# EasyEDA Pro project AmpBoard64TP.eprj, board PCB1
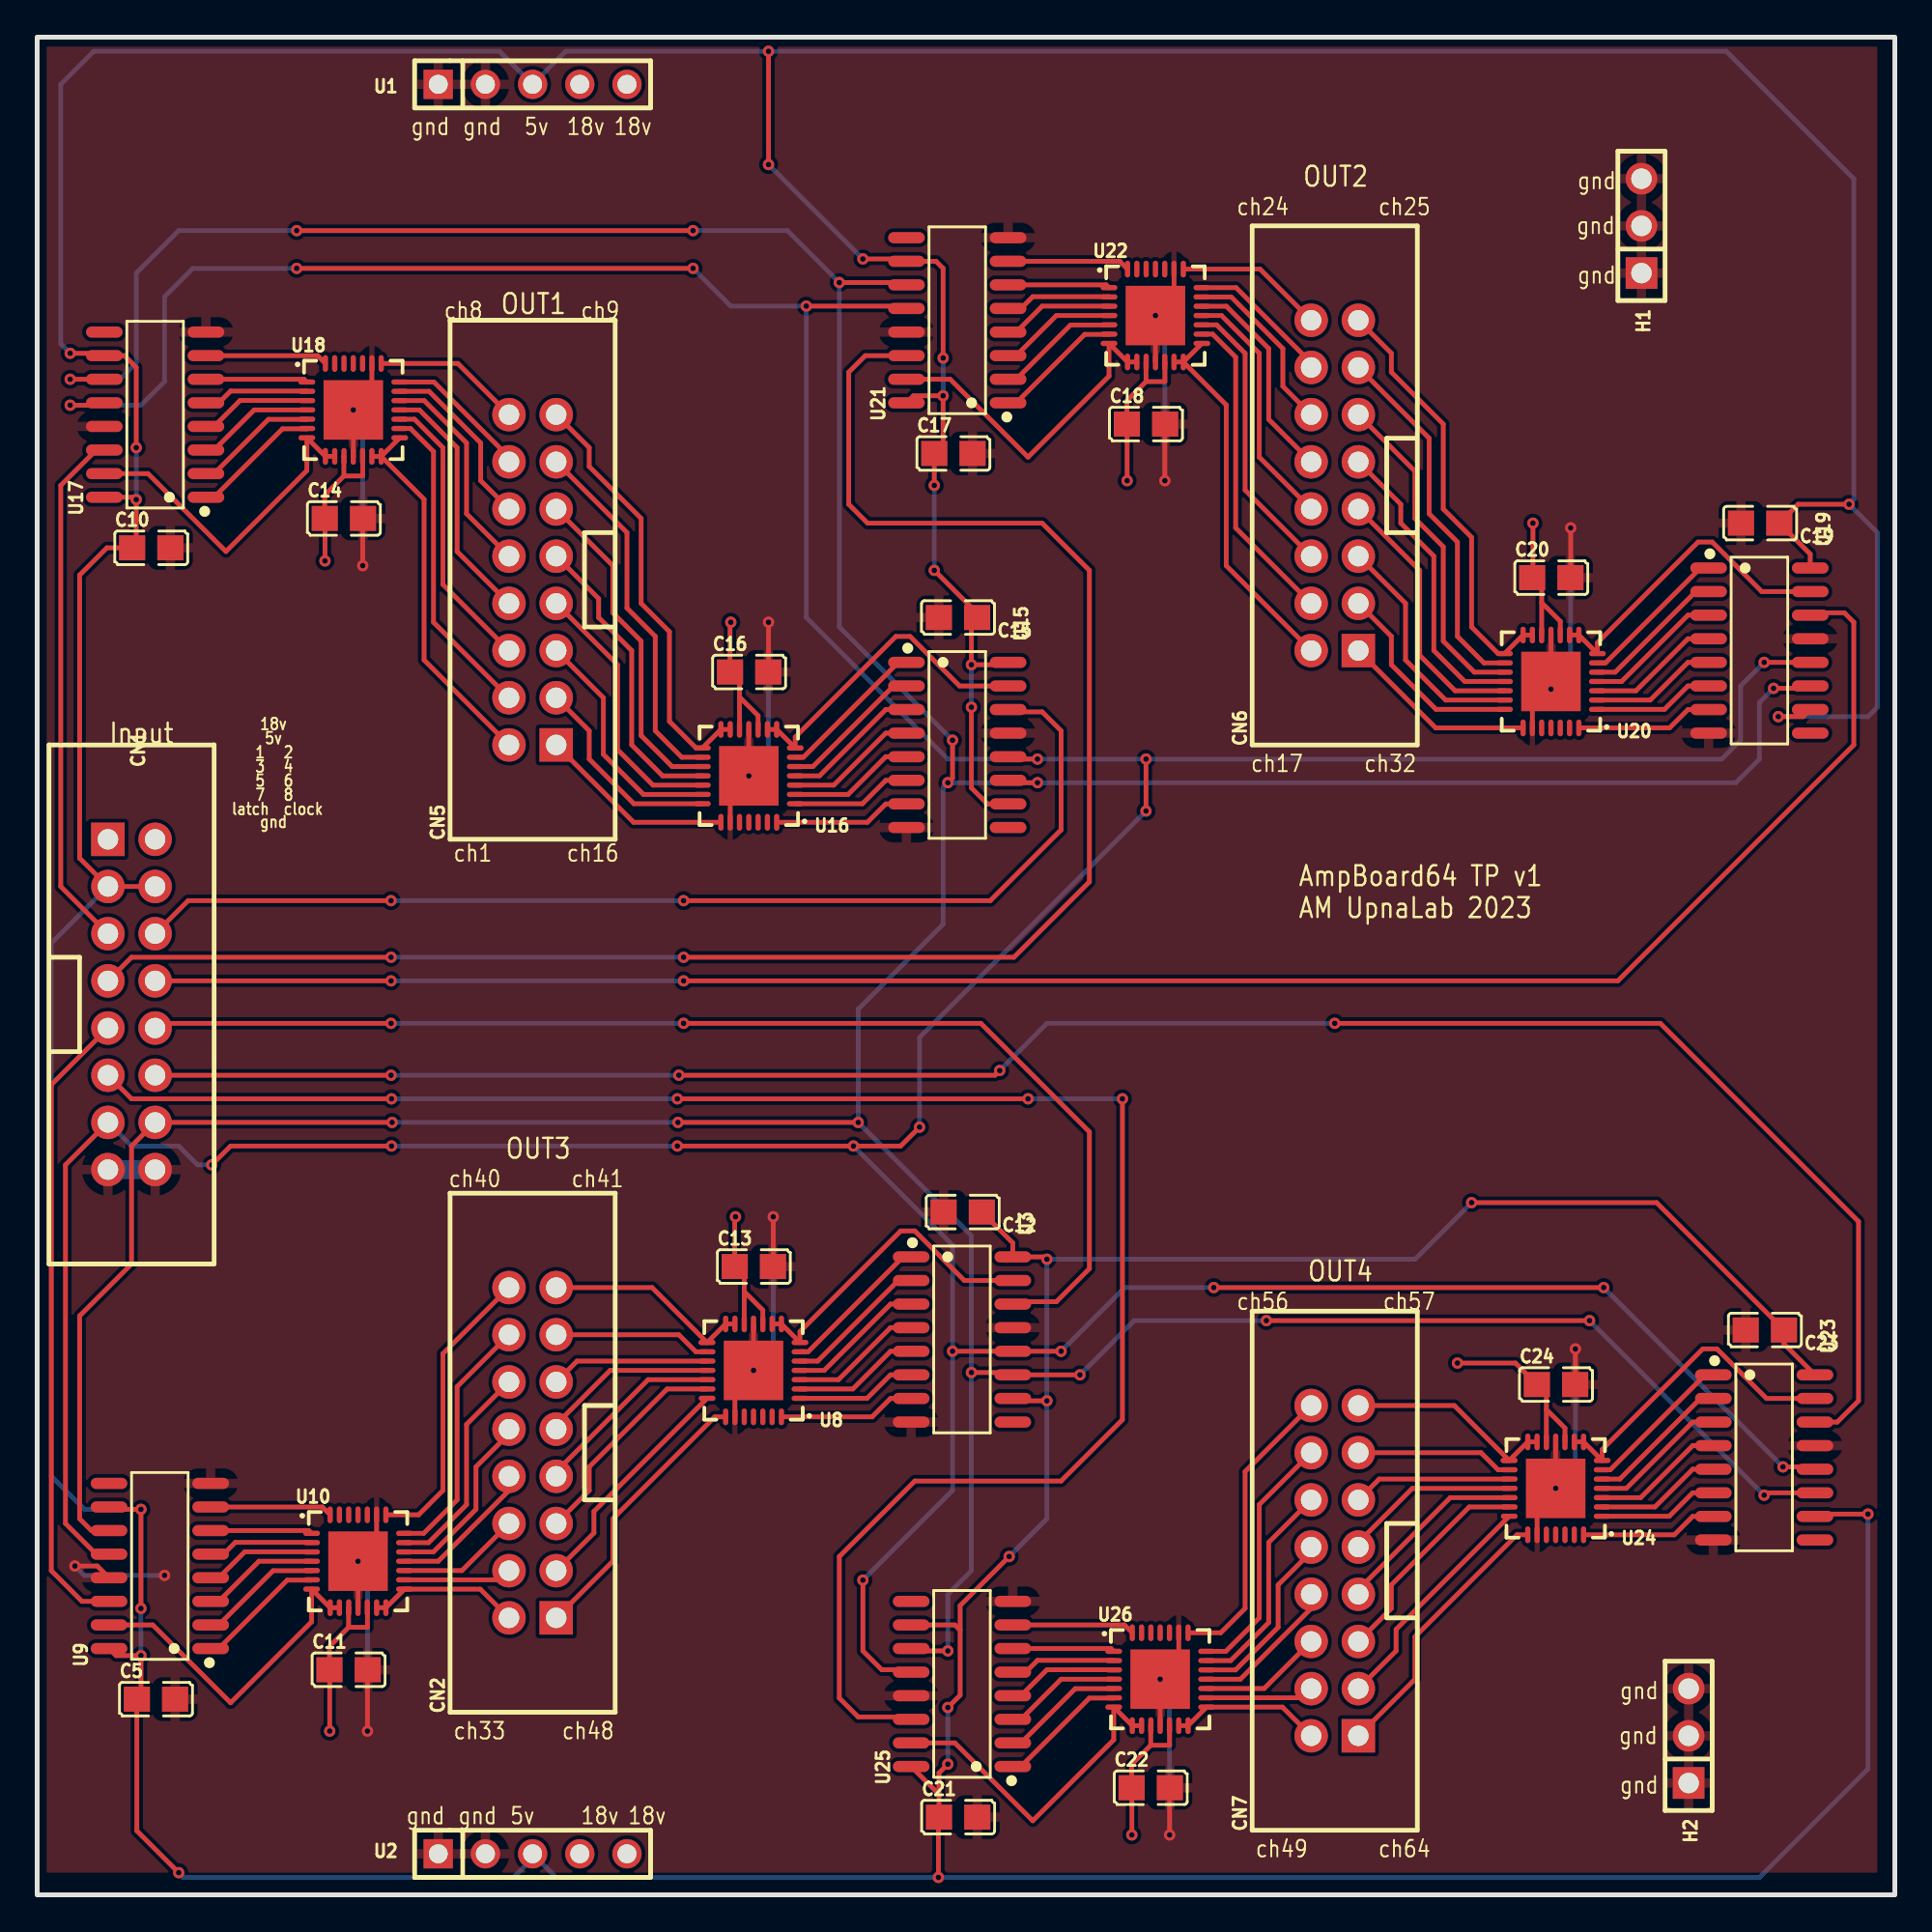
[diagram p3: board, top side]
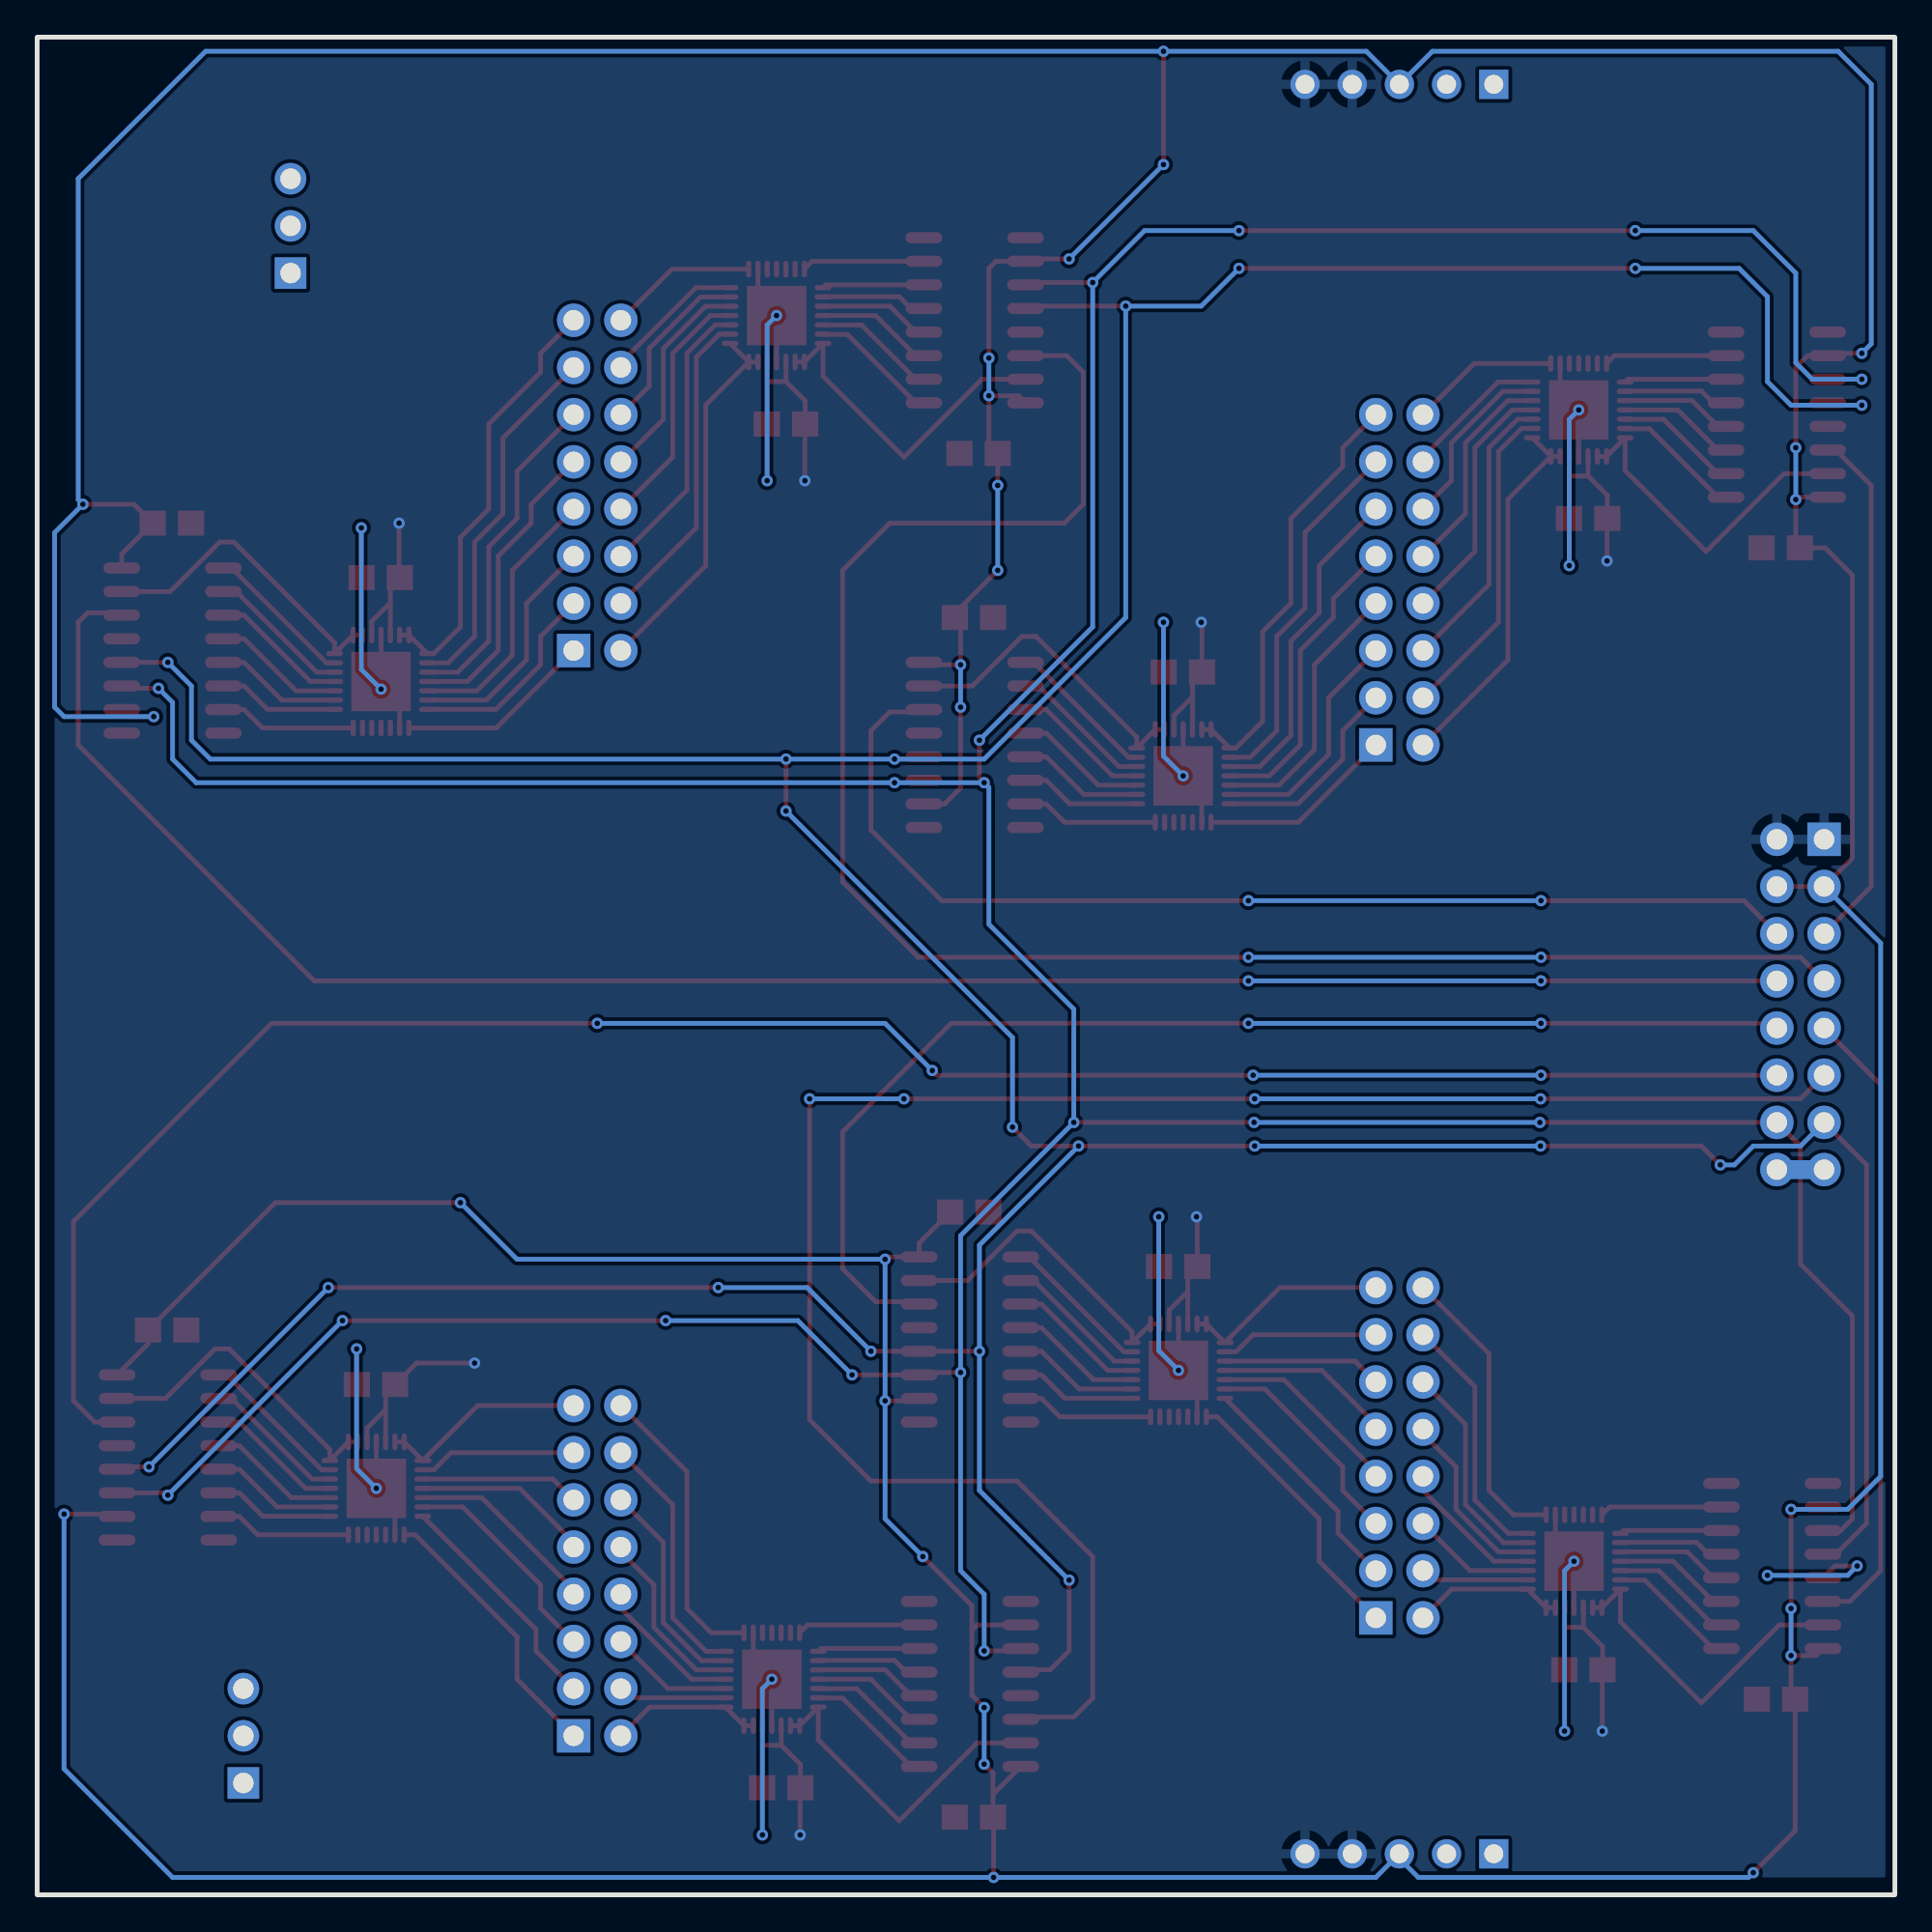
[diagram p4: board, bottom side, seen from below]

Outline 100 x 100 mm; copper layers: Top Layer, Bottom Layer. Coordinates in mm from the lower left corner of the outline.
Outline path: rectangle 0,100 100,0
Stack: Top Layer 0.035mm / Dielectric1 1.51mm FR4 er 4.5 / Bottom Layer 0.035mm

## Design rules (mm)
template: JLCPCB Capability(Two Layers Board)
spacing copperThickness1oz (default): track to track 0.102, other pairs 0.152 to 0.3
spacing copperThickness2oz: track to track 0.203, other pairs 0.152 to 0.3
track width copperThickness1oz (default): min 0.127, default 0.254, max 2.54
track width copperThickness2oz: min 0.203, default 0.254, max 2.54
differential pair differentialPair (default): width min 0.127, default 0.254, max 2.54; gap min 0.152, default 0.152
via viaSize (default): diameter min 0.5, default 0.61, max 10; hole min 0.3, default 0.305, max 6.3

## Placement (name value [footprint] x y rotation side)
C5  100pF  [C0805]  6.4 10.53 0 top
C10  100pF  [C0805]  6.14 72.51 0 top
C11  100pF  [C0805]  16.76 12.12 0 top
C12  100pF  [C0805]  49.82 36.76 180 top
C13  100pF  [C0805]  38.58 33.82 0 top
C14  100pF  [C0805]  16.51 74.09 0 top
C15  100pF  [C0805]  49.57 68.76 180 top
C16  100pF  [C0805]  38.33 65.83 0 top
C17  100pF  [C0805]  49.32 77.59 0 top
C18  100pF  [C0805]  59.69 79.17 0 top
C19  100pF  [C0805]  92.75 73.84 180 top
C20  100pF  [C0805]  81.51 70.91 0 top
C21  100pF  [C0805]  49.58 4.18 0 top
C22  100pF  [C0805]  59.94 5.77 0 top
C23  100pF  [C0805]  93 30.41 180 top
C24  100pF  [C0805]  81.76 27.47 0 top
CN1  KH-2.54PH180-2X8P-L8.9  [conn-th_16p-p2.54_kinghelm_kh-2.54ph180-2x8p-l8.9]  5.08 47.93 270 top
CN2  KH-2.54PH180-2X8P-L8.9  [CONN-TH_16P-P2.54_KINGHELM_KH-2.54PH180-2X8P-L8.9]  26.67 23.8 90 top
CN5  KH-2.54PH180-2X8P-L8.9  [CONN-TH_16P-P2.54_KINGHELM_KH-2.54PH180-2X8P-L8.9]  26.67 70.79 90 top
CN6  KH-2.54PH180-2X8P-L8.9  [CONN-TH_16P-P2.54_KINGHELM_KH-2.54PH180-2X8P-L8.9]  69.85 75.87 90 top
CN7  KH-2.54PH180-2X8P-L8.9  [CONN-TH_16P-P2.54_KINGHELM_KH-2.54PH180-2X8P-L8.9]  69.85 17.45 90 top
H1  KH-2.54PH180-1X3P-L11.5  [hdr-th_3p-p2.54-v-m]  86.36 89.84 90 top
H2  KH-2.54PH180-1X3P-L11.5  [hdr-th_3p-p2.54-v-m]  88.9 8.56 90 top
U1  KH-2.54FH-1X5P-H8.5  [hdr-th_5p-p2.54-v-f]  26.67 97.46 0 top
U2  KH-2.54FH-1X5P-H8.5  [hdr-th_5p-p2.54-v-f]  26.67 2.21 0 top
U3  74HC595D,118  [SOIC-16_L9.9-W3.9-P1.27-LS6.0-BL]  49.78 29.9 270 top
U8  TPS65190RHDR  [VQFN-28_L5.0-W5.0-P0.50-TL-EP3.2]  38.56 28.23 180 top
U9  74HC595D,118  [SOIC-16_L9.9-W3.9-P1.27-LS6.0-BL]  6.6 17.7 90 top
U10  TPS65190RHDR  [VQFN-28_L5.0-W5.0-P0.50-TL-EP3.2]  17.27 17.96 0 top
U15  74HC595D,118  [SOIC-16_L9.9-W3.9-P1.27-LS6.0-BL]  49.53 61.9 270 top
U16  TPS65190RHDR  [VQFN-28_L5.0-W5.0-P0.50-TL-EP3.2]  38.31 60.24 180 top
U17  74HC595D,118  [SOIC-16_L9.9-W3.9-P1.27-LS6.0-BL]  6.35 79.68 90 top
U18  TPS65190RHDR  [VQFN-28_L5.0-W5.0-P0.50-TL-EP3.2]  17.02 79.93 0 top
U19  74HC595D,118  [SOIC-16_L9.9-W3.9-P1.27-LS6.0-BL]  92.71 66.98 270 top
U20  TPS65190RHDR  [VQFN-28_L5.0-W5.0-P0.50-TL-EP3.2]  81.49 65.32 180 top
U21  74HC595D,118  [SOIC-16_L9.9-W3.9-P1.27-LS6.0-BL]  49.53 84.76 90 top
U22  TPS65190RHDR  [VQFN-28_L5.0-W5.0-P0.50-TL-EP3.2]  60.2 85.01 0 top
U23  74HC595D,118  [SOIC-16_L9.9-W3.9-P1.27-LS6.0-BL]  92.96 23.55 270 top
U24  TPS65190RHDR  [VQFN-28_L5.0-W5.0-P0.50-TL-EP3.2]  81.74 21.88 180 top
U25  74HC595D,118  [SOIC-16_L9.9-W3.9-P1.27-LS6.0-BL]  49.78 11.35 90 top
U26  TPS65190RHDR  [VQFN-28_L5.0-W5.0-P0.50-TL-EP3.2]  60.45 11.61 0 top

## Footprints (pads in the part's own frame, mm; a bottom-side part is the same pattern mirrored in y, then rotated)
C0805
  rect 1.41x1.35 smd: 1(-1.03,0) 2(1.03,0)
CONN-TH_16P-P2.54_KINGHELM_KH-2.54PH180-2X8P-L8.9
  rect 1.8x1.8 hole 1.1: 1(-8.89,-1.27)
  round 1.8 hole 1.1: 2(-8.89,1.27) 3(-6.35,-1.27) 4(-6.35,1.27) 5(-3.81,-1.27) 6(-3.81,1.27) 7(-1.27,-1.27) 8(-1.27,1.27) 9(1.27,-1.27) 10(1.27,1.27) 11(3.81,-1.27) 12(3.81,1.27) 13(6.35,-1.27) 14(6.35,1.27) 15(8.89,-1.27) 16(8.89,1.27)
conn-th_16p-p2.54_kinghelm_kh-2.54ph180-2x8p-l8.9
  rect 1.8x1.8 hole 1.1: 1(-8.89,-1.27)
  round 1.8 hole 1.1: 2(-8.89,1.27) 3(-6.35,-1.27) 4(-6.35,1.27) 5(-3.81,-1.27) 6(-3.81,1.27) 7(-1.27,-1.27) 8(-1.27,1.27) 9(1.27,-1.27) 10(1.27,1.27) 11(3.81,-1.27) 12(3.81,1.27) 13(6.35,-1.27) 14(6.35,1.27) 15(8.89,-1.27) 16(8.89,1.27)
hdr-th_3p-p2.54-v-m
  rect 1.7x1.7 hole 1.1: 1(-2.54,0)
  round 1.7 hole 1.1: 2(0,0) 3(2.54,0)
hdr-th_5p-p2.54-v-f
  rect 1.575x1.575 hole 1.02: 1(-5.08,0)
  round 1.575 hole 1.02: 2(-2.54,0) 3(0,0) 4(2.54,0) 5(5.08,0)
SOIC-16_L9.9-W3.9-P1.27-LS6.0-BL
  oval 0.602x1.971 smd: 1(-4.445,-2.736) 2(-3.175,-2.736) 3(-1.905,-2.736) 4(-0.635,-2.736) 5(0.635,-2.736) 6(1.905,-2.736) 7(3.175,-2.736) 8(4.445,-2.736) 9(4.445,2.736) 10(3.175,2.736) 11(1.905,2.736) 12(0.635,2.736) 13(-0.635,2.736) 14(-1.905,2.736) 15(-3.175,2.736) 16(-4.445,2.736)
VQFN-28_L5.0-W5.0-P0.50-TL-EP3.2
  oval 0.9x0.28 smd: 1(-2.5,1.502) 2(-2.5,1.001) 3(-2.5,0.5) 4(-2.5,0) 5(-2.5,-0.5) 6(-2.5,-1) 7(-2.5,-1.501) 15(2.5,-1.501) 16(2.5,-1) 17(2.5,-0.5) 18(2.5,0) 19(2.5,0.5) 20(2.5,1.001) 21(2.5,1.502)
  oval 0.28x0.9 smd: 8(-1.502,-2.5) 9(-1.001,-2.5) 10(-0.5,-2.5) 11(0,-2.5) 12(0.5,-2.5) 13(1,-2.5) 14(1.501,-2.5) 22(1.501,2.5) 23(1,2.5) 24(0.5,2.5) 25(0,2.5) 26(-0.5,2.5) 27(-1.001,2.5) 28(-1.502,2.5)
  rect 3.2x3.2 smd: 29(0,0)

## Nets
+5V: C5.1 C10.1 C12.1 C15.1 C17.1 C19.1 C21.1 C23.1 CN1.3 CN1.4 U1.3 U2.3 U3.10 U3.16 U9.10 U9.16 U15.10 U15.16 U17.10 U17.16 U19.10 U19.16 U21.10 U21.16 U23.10 U23.16 U25.10 U25.16
GND: C5.2 C10.2 C11.2 C12.2 C13.2 C14.2 C15.2 C16.2 C17.2 C18.2 C19.2 C20.2 C21.2 C22.2 C23.2 C24.2 CN1.15 CN1.16 H1.1 H1.2 H1.3 H2.1 H2.2 H2.3 U1.1 U1.2 U2.1 U2.2 U3.8 U3.13 U8.11 U8.23 U8.29 U9.8 U9.13 U10.11 U10.23 U10.29 U15.8 U15.13 U16.11 U16.23 U16.29 U17.8 U17.13 U18.11 U18.23 U18.29 U19.8 U19.13 U20.11 U20.23 U20.29 U21.8 U21.13 U22.11 U22.23 U22.29 U23.8 U23.13 U24.11 U24.23 U24.29 U25.8 U25.13 U26.11 U26.23 U26.29
VCC: C11.1 C13.1 C14.1 C16.1 C18.1 C20.1 C22.1 C24.1 CN1.1 CN1.2 U1.4 U1.5 U2.4 U2.5 U8.10 U8.12 U10.10 U10.12 U16.10 U16.12 U18.10 U18.12 U20.10 U20.12 U22.10 U22.12 U24.10 U24.12 U26.10 U26.12
CLOCK: CN1.14 U3.11 U9.11 U15.11 U17.11 U19.11 U21.11 U23.11 U25.11
LATCH: CN1.13 U3.12 U9.12 U15.12 U17.12 U19.12 U21.12 U23.12 U25.12
MUX1: CN1.5 U17.14
MUX2: CN1.6 U15.14
MUX3: CN1.7 U21.14
MUX4: CN1.8 U19.14
MUX5: CN1.9 U9.14
MUX6: CN1.10 U3.14
MUX7: CN1.11 U25.14
MUX8: CN1.12 U23.14
$1I838/$1N787: CN5.13 U16.16
$1I838/$1N791: CN5.11 U16.17
$1I838/$1N795: CN5.9 U16.18
$1I838/$1N799: CN5.7 U16.19
$1I838/$1N803: CN5.5 U16.20
$1I838/$1N807: CN5.3 U16.21
$1I838/$1N811: CN5.1 U16.22
$1I838/$1N815: CN5.15 U16.13 U16.14 U16.15
$1I838/$1N826: U15.15 U16.7 U16.8 U16.9
$1I838/$1N837: U15.1 U16.6
$1I838/$1N841: U15.2 U16.5
$1I838/$1N845: U15.3 U16.4
$1I838/$1N849: U15.4 U16.3
$1I838/$1N853: U15.5 U16.2
$1I838/$1N857: U15.6 U16.1
$1I838/$1N861: U15.7 U16.28
$1I838/$1N888: CN5.4 U18.16
$1I838/$1N892: CN5.6 U18.17
$1I838/$1N896: CN5.8 U18.18
$1I838/$1N900: CN5.10 U18.19
$1I838/$1N904: CN5.12 U18.20
$1I838/$1N908: CN5.14 U18.21
$1I838/$1N912: CN5.16 U18.22
$1I838/$1N916: CN5.2 U18.13 U18.14 U18.15
$1I838/$1N927: U17.15 U18.7 U18.8 U18.9
$1I838/$1N938: U17.1 U18.6
$1I838/$1N942: U17.2 U18.5
$1I838/$1N946: U17.3 U18.4
$1I838/$1N950: U17.4 U18.3
$1I838/$1N954: U17.5 U18.2
$1I838/$1N958: U17.6 U18.1
$1I838/$1N962: U17.7 U18.28
$1I856/$1N787: CN6.13 U20.16
$1I856/$1N791: CN6.11 U20.17
$1I856/$1N795: CN6.9 U20.18
$1I856/$1N799: CN6.7 U20.19
$1I856/$1N803: CN6.5 U20.20
$1I856/$1N807: CN6.3 U20.21
$1I856/$1N811: CN6.1 U20.22
$1I856/$1N815: CN6.15 U20.13 U20.14 U20.15
$1I856/$1N826: U19.15 U20.7 U20.8 U20.9
$1I856/$1N837: U19.1 U20.6
$1I856/$1N841: U19.2 U20.5
$1I856/$1N845: U19.3 U20.4
$1I856/$1N849: U19.4 U20.3
$1I856/$1N853: U19.5 U20.2
$1I856/$1N857: U19.6 U20.1
$1I856/$1N861: U19.7 U20.28
$1I856/$1N888: CN6.4 U22.16
$1I856/$1N892: CN6.6 U22.17
$1I856/$1N896: CN6.8 U22.18
$1I856/$1N900: CN6.10 U22.19
$1I856/$1N904: CN6.12 U22.20
$1I856/$1N908: CN6.14 U22.21
$1I856/$1N912: CN6.16 U22.22
$1I856/$1N916: CN6.2 U22.13 U22.14 U22.15
$1I856/$1N927: U21.15 U22.7 U22.8 U22.9
$1I856/$1N938: U21.1 U22.6
$1I856/$1N942: U21.2 U22.5
$1I856/$1N946: U21.3 U22.4
$1I856/$1N950: U21.4 U22.3
$1I856/$1N954: U21.5 U22.2
$1I856/$1N958: U21.6 U22.1
$1I856/$1N962: U21.7 U22.28
$1I892/$1N787: CN2.13 U8.16
$1I892/$1N791: CN2.11 U8.17
$1I892/$1N795: CN2.9 U8.18
$1I892/$1N799: CN2.7 U8.19
$1I892/$1N803: CN2.5 U8.20
$1I892/$1N807: CN2.3 U8.21
$1I892/$1N811: CN2.1 U8.22
$1I892/$1N815: CN2.15 U8.13 U8.14 U8.15
$1I892/$1N826: U3.15 U8.7 U8.8 U8.9
$1I892/$1N837: U3.1 U8.6
$1I892/$1N841: U3.2 U8.5
$1I892/$1N845: U3.3 U8.4
$1I892/$1N849: U3.4 U8.3
$1I892/$1N853: U3.5 U8.2
$1I892/$1N857: U3.6 U8.1
$1I892/$1N861: U3.7 U8.28
$1I892/$1N888: CN2.4 U10.16
$1I892/$1N892: CN2.6 U10.17
$1I892/$1N896: CN2.8 U10.18
$1I892/$1N900: CN2.10 U10.19
$1I892/$1N904: CN2.12 U10.20
$1I892/$1N908: CN2.14 U10.21
$1I892/$1N912: CN2.16 U10.22
$1I892/$1N916: CN2.2 U10.13 U10.14 U10.15
$1I892/$1N927: U9.15 U10.7 U10.8 U10.9
$1I892/$1N938: U9.1 U10.6
$1I892/$1N942: U9.2 U10.5
$1I892/$1N946: U9.3 U10.4
$1I892/$1N950: U9.4 U10.3
$1I892/$1N954: U9.5 U10.2
$1I892/$1N958: U9.6 U10.1
$1I892/$1N962: U9.7 U10.28
$1I964/$1N787: CN7.13 U24.16
$1I964/$1N791: CN7.11 U24.17
$1I964/$1N795: CN7.9 U24.18
$1I964/$1N799: CN7.7 U24.19
$1I964/$1N803: CN7.5 U24.20
$1I964/$1N807: CN7.3 U24.21
$1I964/$1N811: CN7.1 U24.22
$1I964/$1N815: CN7.15 U24.13 U24.14 U24.15
$1I964/$1N826: U23.15 U24.7 U24.8 U24.9
$1I964/$1N837: U23.1 U24.6
$1I964/$1N841: U23.2 U24.5
$1I964/$1N845: U23.3 U24.4
$1I964/$1N849: U23.4 U24.3
$1I964/$1N853: U23.5 U24.2
$1I964/$1N857: U23.6 U24.1
$1I964/$1N861: U23.7 U24.28
$1I964/$1N888: CN7.4 U26.16
$1I964/$1N892: CN7.6 U26.17
$1I964/$1N896: CN7.8 U26.18
$1I964/$1N900: CN7.10 U26.19
$1I964/$1N904: CN7.12 U26.20
$1I964/$1N908: CN7.14 U26.21
$1I964/$1N912: CN7.16 U26.22
$1I964/$1N916: CN7.2 U26.13 U26.14 U26.15
$1I964/$1N927: U25.15 U26.7 U26.8 U26.9
$1I964/$1N938: U25.1 U26.6
$1I964/$1N942: U25.2 U26.5
$1I964/$1N946: U25.3 U26.4
$1I964/$1N950: U25.4 U26.3
$1I964/$1N954: U25.5 U26.2
$1I964/$1N958: U25.6 U26.1
$1I964/$1N962: U25.7 U26.28

Pads without a net: U3 9; U8 24 25 26 27; U9 9; U10 24 25 26 27; U15 9; U16 24 25 26 27; U17 9; U18 24 25 26 27; U19 9; U20 24 25 26 27; U21 9; U22 24 25 26 27; U23 9; U24 24 25 26 27; U25 9; U26 24 25 26 27

## Via types
v1: diameter 0.61, hole 0.305, Top Layer to Bottom Layer, 104 vias

## Routing (per net, layer and track width the routed paths; a pad name or vN(x,y) marks a point on that pad's centre or on a via; arc(x,y) is an arc through that point)
+5V: length 520.9
  Top Layer w0.254: v1(48.51,0.94) 48.51,4.15 C21.1 48.55,5.41 ; v1(1.78,82.98) 3.49,82.98 U17.10 4.7,82.86 5.33,82.22 v1(5.33,77.9) ; 48.55,5.41 47.05,6.91 ; 48.55,5.41 48.55,6.56 v1(49.02,7.04) ; v1(52.32,18.21) 49.68,15.57 49.68,14.25 ; v1(48.29,71.3) 50.6,68.99 C15.1 50.29,68.45 v1(50.29,66.22) 52.14,66.22 U15.16 ; 49.68,14.25 49.68,10.75 v1(49.02,10.08) ; 49.68,14.25 49.4,14.53 47.05,14.53 ; U21.16 47.18,80.7 v1(48.77,80.7) 48.77,78.07 C17.1 v1(48.29,75.87) ; v1(54.36,34.21) 54.23,34.34 U3.16 52.52,35.09 C12.1 ; CN1.4 CN1.3 2.29,55.8 2.29,71.04 3.75,72.51 C10.1 5.33,72.73 v1(5.33,75.11) 5.21,75.23 U17.16 ; v1(48.77,82.73) 48.77,87.55 48.39,87.94 U21.10 46.67,88.06 v1(44.45,88.06) ; 95.7,20.37 95.83,20.5 v1(98.55,20.5) ; v1(5.59,15.42) v1(5.59,20.75) 4,20.75 U9.10 ; v1(7.62,1.19) 5.37,3.45 C5.1 5.59,10.76 v1(5.59,12.88) 4.25,12.88 U9.16 ; v1(77.22,37.26) 87.18,37.26 C23.1 94.03,29.66 U23.16 ; v1(39.37,99.24) v1(39.37,93.14) ; v1(97.54,74.85) 94.79,74.85 C19.1 95.45,72.17 95.45,71.42 ; v1(54.36,26.59) 52.65,26.59 U3.10 ; U19.10 95.06,63.42 v1(93.73,63.42) ; 52.27,58.72 51.15,58.72 50.29,59.59 v1(50.29,63.93)
  Bottom Layer w0.254: v1(5.59,15.42) v1(5.59,12.88) ; v1(1.78,82.98) 1.27,83.49 1.27,97.46 3.05,99.24 24.89,99.24 U1.3 28.45,99.24 v1(39.37,99.24) 90.93,99.24 97.79,92.38 97.79,75.11 v1(97.54,74.85) 99.06,73.33 99.06,63.93 98.55,63.42 v1(93.73,63.42) ; v1(48.29,75.87) v1(48.29,71.3) ; v1(49.02,7.04) v1(49.02,10.08) ; v1(98.55,20.5) 98.55,6.78 92.71,0.94 v1(48.51,0.94) 27.94,0.94 U2.3 26.67,1.96 25.65,0.94 7.87,0.94 v1(7.62,1.19) ; v1(52.32,18.21) 54.36,20.24 v1(54.36,26.59) v1(54.36,34.21) 74.17,34.21 v1(77.22,37.26) ; v1(5.59,20.75) 2.54,20.75 0.76,22.53 0.76,51.23 CN1.3 ; v1(5.33,77.9) v1(5.33,75.11) ; v1(39.37,93.14) v1(44.45,88.06) ; v1(50.29,63.93) v1(50.29,66.22) ; v1(48.77,82.73) v1(48.77,80.7)
GND: length 144.5
  Top Layer w0.254: 3.87,17.07 3.23,17.7 v1(2.03,17.7) ; U26.23 61.45,12.61 v1(60.45,11.61) U26.11 ; U20.11 U20.29 v1(81.49,64.9) 80.49,63.9 U20.23 ; U8.11 v1(38.56,28.23) 37.56,27.23 U8.23 ; U18.23 18.02,80.94 v1(17.02,79.93) U18.11 ; C18.2 60.71,79.16 v1(60.71,76.12) ; v1(39.62,36.5) 39.62,33.84 C13.2 ; U22.23 61.2,86.02 v1(60.2,85.01) U22.11 ; C16.2 39.37,65.84 v1(39.37,68.5) ; v1(17.78,8.81) 17.78,12.1 C11.2 ; C20.2 82.55,70.92 v1(82.55,73.58) ; v1(17.53,71.55) 17.53,74.08 C14.2 ; v1(82.8,29.39) 82.8,27.49 C24.2 ; U10.11 v1(17.27,17.96) 18.27,18.96 U10.23 ; U16.11 v1(38.31,60.24) 38.31,59.82 37.31,58.82 U16.23 ; U24.23 80.74,20.88 v1(81.74,21.88) U24.11 ; v1(60.96,3.23) 60.96,5.75 C22.2
  Bottom Layer w0.254: v1(2.03,17.7) 2.54,17.2 v1(6.86,17.2) ; v1(82.55,73.58) 82.55,65.96 v1(81.49,64.9) ; v1(60.96,3.23) 60.96,11.1 v1(60.45,11.61) ; v1(81.74,21.88) 82.8,22.94 v1(82.8,29.39) ; v1(39.37,68.5) 39.37,61.3 v1(38.31,60.24) ; v1(17.78,8.81) 17.78,17.45 v1(17.27,17.96) ; v1(60.2,85.01) 60.71,84.51 v1(60.71,76.12) ; v1(39.62,36.5) 39.62,29.29 v1(38.56,28.23) ; v1(17.02,79.93) 17.53,79.43 v1(17.53,71.55)
  Bottom Layer w1.016: CN1.15 CN1.16
VCC: length 69.5
  Top Layer w0.254: 59.69,81.46 59.69,82.51 U22.10 ; 59.69,81.46 58.66,80.43 C18.1 58.67,79.16 v1(58.67,76.12) ; 59.69,81.46 60.71,81.46 60.71,82.51 U22.12 ; U26.12 60.96,9.1 60.96,8.05 59.94,8.05 ; U10.12 17.78,15.45 17.78,14.4 16.76,14.4 ; 37.81,64.48 U16.12 ; 37.81,64.48 38.81,63.48 U16.10 ; 37.81,64.48 37.81,65.31 C16.1 37.3,68.46 v1(37.34,68.5) ; 81.24,26.12 U24.12 ; 81.24,26.12 81.24,26.96 C24.1 79.58,28.63 v1(76.45,28.63) ; 81.24,26.12 82.24,25.12 U24.10 ; 59.94,8.05 59.94,9.1 U26.10 ; 59.94,8.05 58.91,7.02 C22.1 58.93,5.75 v1(58.93,3.23) ; v1(80.52,73.84) 80.52,70.95 C20.1 80.99,70.39 80.99,69.56 ; 16.76,14.4 15.73,13.37 C11.1 15.75,12.1 v1(15.75,8.81) ; 16.76,14.4 16.76,15.45 U10.10 ; v1(15.49,71.81) 15.49,74.08 C14.1 15.48,75.35 16.51,76.38 ; U18.10 16.51,77.43 16.51,76.38 ; U18.12 17.53,77.43 17.53,76.38 16.51,76.38 ; 80.99,69.56 81.99,68.56 U20.10 ; 80.99,69.56 U20.12 ; U8.10 39.06,31.47 38.06,32.47 ; 38.06,32.47 38.06,33.31 C13.1 37.55,36.46 v1(37.59,36.5) ; 38.06,32.47 U8.12
CLOCK: length 302.9
  Top Layer w0.254: v1(19.11,41.58) CN1.14 5.08,40.31 5.08,33.96 2.29,31.17 2.29,20.24 2.92,19.61 U9.11 ; 3.61,81.58 v1(1.78,81.58) ; v1(49.02,13.13) 47.18,13.13 U25.11 ; U15.11 52.39,59.87 v1(53.85,59.87) ; U21.11 46.67,86.79 v1(43.18,86.79) ; v1(50.29,28.12) 52.39,28.12 U3.11 v1(56.13,27.99) ; U19.11 95.32,64.95 v1(93.47,64.95) ; v1(83.57,30.91) v1(66.17,30.91) ; v1(92.96,21.51) 93.09,21.64 U23.11 ; v1(49.28,62.15) 49.28,60.12 v1(49.02,59.87) ; v1(34.49,41.58) v1(44.2,41.58) ; v1(13.97,89.59) v1(35.31,89.59)
  Bottom Layer w0.254: v1(13.97,89.59) 7.62,89.59 5.33,87.3 5.33,82.47 4.44,81.58 v1(1.78,81.58) ; v1(35.31,89.59) 40.39,89.59 v1(43.18,86.79) 43.18,68.25 v1(49.28,62.15) ; v1(66.17,30.91) 59.06,30.91 v1(56.13,27.99) ; v1(92.96,21.51) v1(83.57,30.91) ; v1(19.11,41.58) v1(34.49,41.58) ; v1(49.02,13.13) 49.02,16.18 50.29,17.45 v1(50.29,28.12) 50.29,35.48 v1(44.2,41.58) 44.2,47.68 48.77,52.25 48.77,59.61 v1(49.02,59.87) v1(53.85,59.87) 91.44,59.87 92.71,61.14 92.71,64.19 v1(93.47,64.95)
LATCH: length 315
  Top Layer w0.254: v1(41.4,85.52) 46.67,85.52 U21.12 ; v1(55.12,29.26) U3.12 v1(49.28,29.26) ; v1(53.85,61.14) 52.39,61.14 U15.12 ; v1(63.34,32.69) v1(84.33,32.69) ; U17.12 3.49,80.19 v1(1.78,80.19) ; v1(19.07,40.31) 10.41,40.31 v1(9.4,39.29) ; U19.12 v1(92.96,66.34) ; v1(59.69,58.34) v1(59.69,61.14) ; U25.12 46.92,12.12 45.47,12.12 44.45,13.13 v1(44.45,16.94) ; v1(34.46,40.31) v1(43.94,40.31) 46.48,40.31 v1(47.5,41.33) ; v1(93.98,23.04) 95.5,23.04 ; CN1.13 1.52,39.29 1.52,19.99 3.17,18.34 U9.12 ; v1(35.31,87.55) v1(13.97,87.55)
  Bottom Layer w0.254: v1(47.5,41.33) 47.5,46.15 v1(59.69,58.34) ; v1(55.12,29.26) 58.55,32.69 v1(63.34,32.69) ; v1(35.31,87.55) 37.34,85.52 v1(41.4,85.52) 41.4,68.76 49.02,61.14 v1(53.85,61.14) v1(59.69,61.14) 90.68,61.14 91.69,62.15 91.69,65.08 v1(92.96,66.34) ; v1(84.33,32.69) v1(93.98,23.04) ; v1(19.07,40.31) v1(34.46,40.31) ; CN1.13 5.08,40.31 7.62,40.31 8.64,39.29 v1(9.4,39.29) ; v1(13.97,87.55) 8.38,87.55 6.86,86.03 6.86,81.46 5.59,80.19 v1(1.78,80.19) ; v1(44.45,16.94) 49.28,21.77 v1(49.28,29.26) 49.28,34.98 v1(43.94,40.31)
MUX1: length 28.3
  Top Layer w0.254: CN1.5 1.27,54.28 1.27,75.87 3.17,77.78 U17.14
MUX2: length 59.7
  Top Layer w0.254: v1(34.8,53.52) 51.31,53.52 55.12,57.33 55.12,62.66 54.1,63.68 52.39,63.68 U15.14 ; CN1.6 8.13,53.52 v1(19.05,53.52)
  Bottom Layer w0.254: v1(19.05,53.52) v1(34.8,53.52)
MUX3: length 96.8
  Top Layer w0.254: v1(19.05,50.47) 5.08,50.47 CN1.7 ; U21.14 44.58,82.86 43.69,81.97 43.69,74.85 44.7,73.84 54.1,73.84 56.64,71.3 56.64,54.53 52.58,50.47 v1(34.8,50.47)
  Bottom Layer w0.254: v1(19.05,50.47) v1(34.8,50.47)
MUX4: length 105.9
  Top Layer w0.254: v1(19.05,49.2) CN1.8 ; U19.14 95.57,69.01 97.28,69.01 97.79,68.5 97.79,61.9 85.09,49.2 v1(34.8,49.2)
  Bottom Layer w0.254: v1(19.05,49.2) v1(34.8,49.2)
MUX5: length 34.3
  Top Layer w0.254: U9.14 2.41,15.8 0.76,17.45 0.76,43.61 CN1.9
MUX6: length 65.1
  Top Layer w0.254: CN1.10 6.6,46.91 v1(19.05,46.91) ; U3.14 52.65,31.93 54.86,31.93 56.64,33.71 56.64,41.07 50.8,46.91 v1(34.8,46.91)
  Bottom Layer w0.254: v1(19.05,46.91) v1(34.8,46.91)
MUX7: length 102.7
  Top Layer w0.254: U25.14 46.92,9.58 44.2,9.58 43.18,10.59 43.18,18.21 47.24,22.28 55.12,22.28 58.42,25.58 v1(58.42,42.85) ; v1(19.07,42.85) 5.08,42.85 CN1.11 ; v1(34.46,42.85) v1(53.34,42.85)
  Bottom Layer w0.254: v1(19.07,42.85) v1(34.46,42.85) ; v1(58.42,42.85) v1(53.34,42.85)
MUX8: length 109.7
  Top Layer w0.254: v1(51.82,44.37) 51.56,44.12 v1(34.54,44.12) ; v1(69.85,46.91) 87.38,46.91 98.04,36.25 98.04,26.59 96.9,25.45 U23.14 ; v1(19.05,44.12) CN1.12
  Bottom Layer w0.254: v1(51.82,44.37) 54.36,46.91 v1(69.85,46.91) ; v1(19.05,44.12) v1(34.54,44.12)
$1I838/$1N787: length 19.8
  Top Layer w0.254: U16.16 34.7,61.24 33.27,62.66 33.27,67.74 31.75,69.27 31.75,73.33 CN5.13
$1I838/$1N791: length 18.1
  Top Layer w0.254: CN5.11 30.99,71.55 30.99,69.01 32.51,67.49 32.51,62.41 34.18,60.74 U16.17
$1I838/$1N795: length 16.3
  Top Layer w0.254: CN5.9 30.23,69.77 30.23,68.76 32,66.98 32,61.9 33.67,60.24 U16.18
$1I838/$1N799: length 14.6
  Top Layer w0.254: CN5.7 31.24,66.22 31.24,61.65 33.15,59.74 U16.19
$1I838/$1N803: length 12.9
  Top Layer w0.254: U16.20 32.64,59.23 30.48,61.39 30.48,64.44 CN5.5
$1I838/$1N807: length 11.1
  Top Layer w0.254: U16.21 32.12,58.73 29.72,61.14 29.72,62.66 CN5.3
$1I838/$1N811: length 10.6
  Top Layer w0.254: CN5.1 32.1,57.74 U16.22
$1I838/$1N815: length 23.3
  Top Layer w0.254: CN5.15 29.72,77.9 29.72,76.89 32.51,74.09 32.51,69.52 34.04,68 34.04,63.17 35.47,61.74 35.81,61.74 U16.14 U16.13
$1I838/$1N826: length 17.3
  Top Layer w0.254: U15.15 49.66,65.08 46.99,67.74 46.23,67.74 40.81,62.32 40.81,61.74 U16.8 39.31,62.74
$1I838/$1N837: length 8.1
  Top Layer w0.254: U16.6 41.25,61.24 46.35,66.34 U15.1
$1I838/$1N841: length 7.8
  Top Layer w0.254: U15.2 46.1,65.08 41.76,60.74 U16.5
$1I838/$1N845: length 7.5
  Top Layer w0.254: U15.3 45.68,63.81 42.11,60.24 U16.4
$1I838/$1N849: length 7.1
  Top Layer w0.254: U16.3 42.88,59.74 45.68,62.53 U15.4
$1I838/$1N853: length 6.8
  Top Layer w0.254: U15.5 45.68,61.27 43.65,59.23 U16.2
$1I838/$1N857: length 6.5
  Top Layer w0.254: U16.1 44.42,58.73 45.68,60 U15.6
$1I838/$1N861: length 7.4
  Top Layer w0.254: U16.28 44.69,57.74 45.68,58.72 46.79,58.72
$1I838/$1N888: length 17.3
  Top Layer w0.254: CN5.4 21.34,68.5 21.34,77.69 20.09,78.93 U18.16
$1I838/$1N892: length 15.4
  Top Layer w0.254: CN5.6 21.84,70.54 21.84,77.9 20.31,79.43 U18.17
$1I838/$1N896: length 13.5
  Top Layer w0.254: U18.18 20.57,79.93 22.61,77.9 22.61,72.31 CN5.8
$1I838/$1N900: length 11.6
  Top Layer w0.254: U18.19 20.84,80.43 23.11,78.16 23.11,74.35 CN5.10
$1I838/$1N904: length 9.7
  Top Layer w0.254: U18.20 21.1,80.94 23.88,78.16 23.88,76.12 CN5.12
$1I838/$1N908: length 7.8
  Top Layer w0.254: U18.21 21.36,81.44 25.4,77.39 CN5.14
$1I838/$1N912: length 8
  Top Layer w0.254: U18.22 22.65,82.43 CN5.16
$1I838/$1N916: length 20.3
  Top Layer w0.254: CN5.2 20.83,66.47 20.83,75.12 U18.14 ; U18.13 U18.14 ; U18.14 U18.15
$1I838/$1N927: length 18.1
  Top Layer w0.254: U18.9 U18.8 U18.7 14.52,76.67 10.16,72.31 5.97,76.5 3.61,76.5
$1I838/$1N938: length 7
  Top Layer w0.254: U17.1 9.53,75.23 13.21,78.92 14.5,78.92 U18.6
$1I838/$1N942: length 6.6
  Top Layer w0.254: 9.09,76.5 9.53,76.5 12.45,79.43 14.51,79.43 U18.5
$1I838/$1N946: length 6.3
  Top Layer w0.254: U17.3 9.53,77.78 11.68,79.93 U18.4
$1I838/$1N950: length 6
  Top Layer w0.254: U17.4 9.53,79.05 10.92,80.44 14.51,80.44 U18.3
$1I838/$1N954: length 5.7
  Top Layer w0.254: U17.5 9.78,80.31 10.41,80.95 14.5,80.95 U18.2
$1I838/$1N958: length 5.5
  Top Layer w0.254: U18.1 14.37,81.58 9.09,81.58
$1I838/$1N962: length 6.6
  Top Layer w0.254: U17.7 15.1,82.86 U18.28
$1I856/$1N787: length 19.8
  Top Layer w0.254: CN6.13 74.93,78.41 74.93,74.35 76.45,72.82 76.45,67.74 77.88,66.32 U20.16
$1I856/$1N791: length 18.1
  Top Layer w0.254: U20.17 77.36,65.82 75.69,67.49 75.69,72.57 74.17,74.09 74.17,76.63 CN6.11
$1I856/$1N795: length 16.3
  Top Layer w0.254: CN6.9 73.41,74.85 73.41,73.84 75.18,72.06 75.18,66.98 76.85,65.32 U20.18
$1I856/$1N799: length 14.6
  Top Layer w0.254: CN6.7 74.42,71.3 74.42,66.73 76.33,64.82 U20.19
$1I856/$1N803: length 12.9
  Top Layer w0.254: U20.20 75.82,64.31 73.66,66.47 73.66,69.52 CN6.5
$1I856/$1N807: length 11.1
  Top Layer w0.254: CN6.3 72.9,67.74 72.9,66.22 75.3,63.81 U20.21
$1I856/$1N811: length 10.6
  Top Layer w0.254: CN6.1 75.28,62.82 U20.22
$1I856/$1N815: length 23.3
  Top Layer w0.254: CN6.15 72.9,82.98 72.9,81.97 75.69,79.17 75.69,74.6 77.22,73.08 77.22,68.25 78.65,66.82 U20.15 U20.14 U20.13
$1I856/$1N826: length 17.3
  Top Layer w0.254: 82.49,67.82 U20.8 U20.7 83.99,67.4 89.41,72.82 90.17,72.82 92.84,70.16 U19.15
$1I856/$1N837: length 8.1
  Top Layer w0.254: 89.97,71.42 89.53,71.42 84.43,66.32 U20.6
$1I856/$1N841: length 7.8
  Top Layer w0.254: U20.5 84.94,65.82 89.28,70.16 U19.2
$1I856/$1N845: length 7.5
  Top Layer w0.254: U19.3 88.86,68.89 85.29,65.32 U20.4
$1I856/$1N849: length 7.1
  Top Layer w0.254: U20.3 86.06,64.82 88.86,67.61 U19.4
$1I856/$1N853: length 6.8
  Top Layer w0.254: U19.5 88.86,66.34 86.83,64.31 U20.2
$1I856/$1N857: length 6.5
  Top Layer w0.254: U19.6 88.86,65.08 87.6,63.81 U20.1
$1I856/$1N861: length 7.4
  Top Layer w0.254: U19.7 88.86,63.81 87.87,62.82 U20.28
$1I856/$1N888: length 17.3
  Top Layer w0.254: CN6.4 64.52,73.58 64.52,82.77 63.28,84.01 U22.16
$1I856/$1N892: length 15.4
  Top Layer w0.254: U22.17 63.49,84.51 65.02,82.98 65.02,75.62 CN6.6
$1I856/$1N896: length 13.5
  Top Layer w0.254: CN6.8 65.79,77.39 65.79,82.98 63.75,85.01 U22.18
$1I856/$1N900: length 11.6
  Top Layer w0.254: CN6.10 66.29,79.43 66.29,83.24 64.02,85.51 U22.19
$1I856/$1N904: length 9.7
  Top Layer w0.254: CN6.12 67.06,81.2 67.06,83.24 64.28,86.02 U22.20
$1I856/$1N908: length 7.8
  Top Layer w0.254: U22.21 64.54,86.52 68.58,82.47 CN6.14
$1I856/$1N912: length 8
  Top Layer w0.254: U22.22 65.83,87.51 CN6.16
$1I856/$1N916: length 20.3
  Top Layer w0.254: CN6.2 64.01,71.55 64.01,80.2 U22.14 ; U22.14 U22.13 ; U22.14 U22.15
$1I856/$1N927: length 18.1
  Top Layer w0.254: 46.79,81.58 49.15,81.58 53.34,77.39 57.7,81.75 U22.7 U22.8 U22.9
$1I856/$1N938: length 7
  Top Layer w0.254: U22.6 57.68,84 56.39,84 52.71,80.31 U21.1
$1I856/$1N942: length 6.6
  Top Layer w0.254: 52.27,81.58 52.71,81.58 55.63,84.51 57.69,84.51 U22.5
$1I856/$1N946: length 6.3
  Top Layer w0.254: U22.4 54.86,85.01 52.71,82.86 U21.3
$1I856/$1N950: length 6
  Top Layer w0.254: U22.3 57.69,85.52 54.1,85.52 52.71,84.12 U21.4
$1I856/$1N954: length 5.7
  Top Layer w0.254: U21.5 52.96,85.39 53.59,86.03 57.68,86.03 U22.2
$1I856/$1N958: length 5.5
  Top Layer w0.254: U21.6 57.55,86.67 U22.1
$1I856/$1N962: length 6.6
  Top Layer w0.254: U21.7 58.28,87.94 U22.28
$1I892/$1N787: length 8.5
  Top Layer w0.254: U8.16 35.46,29.23 34.54,30.15 CN2.13
$1I892/$1N791: length 8.6
  Top Layer w0.254: U8.17 29.06,28.73 CN2.11
$1I892/$1N795: length 9.6
  Top Layer w0.254: U8.18 30.85,28.23 27.94,25.32 CN2.9
$1I892/$1N799: length 10.4
  Top Layer w0.254: U8.19 32.89,27.73 27.94,22.78 CN2.7
$1I892/$1N803: length 11.9
  Top Layer w0.254: CN2.5 29.72,21.77 29.72,23.04 33.91,27.23 U8.20
$1I892/$1N807: length 12.6
  Top Layer w0.254: CN2.3 29.97,19.48 29.97,20.64 U8.21
$1I892/$1N811: length 14.9
  Top Layer w0.254: U8.22 36.48,25.73 30.99,20.24 30.99,17.96 CN2.1
$1I892/$1N815: length 11.6
  Top Layer w0.254: U8.15 U8.14 U8.13 ; U8.15 33.1,32.69 CN2.15 ; U8.15 35.72,29.73
$1I892/$1N826: length 17.3
  Top Layer w0.254: 52.52,33.07 49.91,33.07 47.24,35.74 46.48,35.74 41.06,30.32 U8.7 U8.8 U8.9
$1I892/$1N837: length 8.1
  Top Layer w0.254: U3.1 46.61,34.34 41.5,29.23 U8.6
$1I892/$1N841: length 7.8
  Top Layer w0.254: U8.5 42.02,28.73 46.35,33.07 47.05,33.07
$1I892/$1N845: length 7.5
  Top Layer w0.254: U8.4 42.37,28.23 45.94,31.8 U3.3
$1I892/$1N849: length 7.1
  Top Layer w0.254: U8.3 43.14,27.73 45.94,30.53 47.05,30.53
$1I892/$1N853: length 6.8
  Top Layer w0.254: U3.5 45.94,29.26 43.91,27.23 U8.2
$1I892/$1N857: length 6.5
  Top Layer w0.254: U3.6 45.94,27.99 44.68,26.73 U8.1
$1I892/$1N861: length 7.4
  Top Layer w0.254: U8.28 44.95,25.73 45.94,26.72 U3.7
$1I892/$1N888: length 5.8
  Top Layer w0.254: U10.16 24.91,16.96 CN2.4
$1I892/$1N892: length 6.7
  Top Layer w0.254: U10.17 22.87,17.46 CN2.6
$1I892/$1N896: length 8
  Top Layer w0.254: U10.18 21.59,17.96 25.4,21.77 CN2.8
$1I892/$1N900: length 9.9
  Top Layer w0.254: U10.19 21.33,18.46 23.62,20.75 23.62,23.04 25.4,24.82 CN2.10
$1I892/$1N904: length 11.7
  Top Layer w0.254: CN2.12 23.11,25.32 23.11,21.01 21.07,18.96 U10.20
$1I892/$1N908: length 13.6
  Top Layer w0.254: CN2.14 22.61,27.36 22.61,21.26 20.81,19.46 U10.21
$1I892/$1N912: length 16
  Top Layer w0.254: CN2.16 21.84,29.13 21.84,21.77 20.53,20.46 18.77,20.46
$1I892/$1N916: length 8.2
  Top Layer w0.254: CN2.2 23.85,16.46 U10.15 18.77,15.46 U10.13
$1I892/$1N927: length 18.1
  Top Layer w0.254: U10.9 U10.8 U10.7 14.77,14.7 10.41,10.34 6.22,14.53 U9.15
$1I892/$1N938: length 7
  Top Layer w0.254: U9.1 9.78,13.26 13.46,16.94 14.76,16.94 U10.6
$1I892/$1N942: length 6.6
  Top Layer w0.254: U9.2 9.78,14.53 12.7,17.45 14.76,17.45 U10.5
$1I892/$1N946: length 6.3
  Top Layer w0.254: U9.3 9.78,15.8 11.94,17.96 U10.4
$1I892/$1N950: length 6
  Top Layer w0.254: U10.3 14.76,18.47 11.18,18.47 9.78,17.07 9.34,17.07
$1I892/$1N954: length 5.7
  Top Layer w0.254: U10.2 14.76,18.97 10.67,18.97 10.03,18.34 U9.5
$1I892/$1N958: length 5.5
  Top Layer w0.254: U9.6 14.62,19.61 U10.1
$1I892/$1N962: length 6.6
  Top Layer w0.254: U9.7 15.35,20.88 U10.28
$1I964/$1N787: length 8.5
  Top Layer w0.254: CN7.13 77.72,23.8 78.64,22.88 U24.16
$1I964/$1N791: length 8.6
  Top Layer w0.254: CN7.11 72.24,22.38 U24.17
$1I964/$1N795: length 9.6
  Top Layer w0.254: CN7.9 71.12,18.97 74.03,21.88 U24.18
$1I964/$1N799: length 10.4
  Top Layer w0.254: U24.19 76.07,21.38 71.12,16.43 CN7.7
$1I964/$1N803: length 11.9
  Top Layer w0.254: U24.20 77.09,20.88 72.9,16.69 72.9,15.42 CN7.5
$1I964/$1N807: length 12.6
  Top Layer w0.254: CN7.3 73.15,13.13 73.15,14.29 U24.21
$1I964/$1N811: length 14.9
  Top Layer w0.254: CN7.1 74.17,11.61 74.17,13.89 79.66,19.38 U24.22
$1I964/$1N815: length 11.6
  Top Layer w0.254: CN7.15 76.28,26.34 U24.15 ; U24.15 78.9,23.38 ; U24.15 U24.14 U24.13
$1I964/$1N826: length 17.3
  Top Layer w0.254: U23.15 93.09,26.72 90.42,29.39 89.66,29.39 84.24,23.97 U24.7 U24.8 U24.9
$1I964/$1N837: length 8.1
  Top Layer w0.254: U23.1 89.79,27.99 84.68,22.88 U24.6
$1I964/$1N841: length 7.8
  Top Layer w0.254: U24.5 85.2,22.38 89.53,26.72 U23.2
$1I964/$1N845: length 7.5
  Top Layer w0.254: U23.3 89.12,25.45 85.55,21.88 U24.4
$1I964/$1N849: length 7.1
  Top Layer w0.254: U23.4 89.12,24.18 86.32,21.38 U24.3
$1I964/$1N853: length 6.8
  Top Layer w0.254: U23.5 89.12,22.91 87.09,20.88 U24.2
$1I964/$1N857: length 6.5
  Top Layer w0.254: U23.6 89.12,21.64 87.86,20.38 U24.1
$1I964/$1N861: length 7.4
  Top Layer w0.254: 90.23,20.37 89.12,20.37 88.13,19.38 U24.28
$1I964/$1N888: length 5.8
  Top Layer w0.254: CN7.4 68.09,10.61 U26.16
$1I964/$1N892: length 6.7
  Top Layer w0.254: CN7.6 66.05,11.11 U26.17
$1I964/$1N896: length 8
  Top Layer w0.254: CN7.8 68.58,15.42 64.77,11.61 U26.18
$1I964/$1N900: length 9.9
  Top Layer w0.254: U26.19 64.51,12.11 66.8,14.4 66.8,16.69 68.58,18.47 CN7.10
$1I964/$1N904: length 11.7
  Top Layer w0.254: U26.20 64.25,12.61 66.29,14.66 66.29,18.97 CN7.12
$1I964/$1N908: length 13.6
  Top Layer w0.254: CN7.14 65.79,21.01 65.79,14.91 63.99,13.11 U26.21
$1I964/$1N912: length 16
  Top Layer w0.254: CN7.16 65.02,22.78 65.02,15.42 63.71,14.11 U26.22
$1I964/$1N916: length 8.2
  Top Layer w0.254: CN7.2 67.03,10.11 U26.15 U26.14 U26.13
$1I964/$1N927: length 18.1
  Top Layer w0.254: U26.9 U26.8 U26.7 57.95,8.35 53.59,3.99 49.4,8.18 U25.15
$1I964/$1N938: length 7
  Top Layer w0.254: 52.52,6.91 52.96,6.91 56.64,10.59 57.94,10.59 U26.6
$1I964/$1N942: length 6.6
  Top Layer w0.254: U26.5 57.94,11.1 55.88,11.1 52.96,8.18 U25.2
$1I964/$1N946: length 6.3
  Top Layer w0.254: U26.4 55.12,11.61 52.96,9.45 U25.3
$1I964/$1N950: length 6
  Top Layer w0.254: U25.4 52.96,10.72 54.36,12.12 57.94,12.12 U26.3
$1I964/$1N954: length 5.7
  Top Layer w0.254: U26.2 57.94,12.62 53.85,12.62 53.21,11.99 U25.5
$1I964/$1N958: length 5.5
  Top Layer w0.254: U25.6 57.8,13.26 U26.1
$1I964/$1N962: length 6.6
  Top Layer w0.254: U26.28 58.53,14.53 52.52,14.53

## Copper pours and planes (outline as drawn; the poured copper is in the pictures)
GND on Top Layer: 0.51,99.49 99.06,99.49 99.06,1.19 0.51,1.19
VCC on Bottom Layer: 0.51,99.49 99.06,99.49 99.06,0.94 0.51,0.94

## Text on the board
Top Silkscreen Layer: latch | 1 | 3 | 5 | 7 | gnd | 18v | 5v | 2 | 4 | 6 | 8 | clock | ch8 | ch40 | ch1 | ch33 | ch48 | ch16 | ch41 | ch9 | ch24 | ch56 | ch17 | ch49 | ch32 | ch25 | ch64 | ch57 | Input | AmpBoard64 TP v1 / AM UpnaLab 2023 | OUT1 | OUT3 | OUT4 | OUT2
